# Altium schematic sheet two.SchDoc
size A4
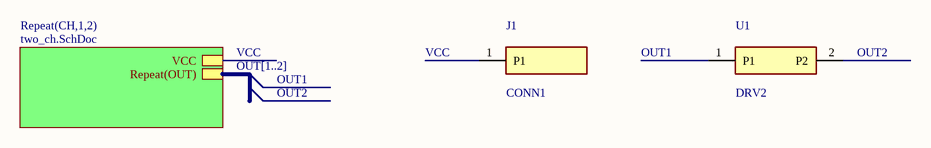
[diagram p0: two.SchDoc]

## Parts
J1  CONN1
U1  DRV2

## Sub-sheets
Repeat(CH,1,2) = two_ch.SchDoc: VCC, Repeat(OUT)

## Nets
OUT1: U1.1(P1)
OUT2: U1.2(P2)
VCC: J1.1(P1) ; sheet Repeat(CH,1,2)/VCC

## Buses and harness runs
bus OUT[1..2] = sheet Repeat(CH,1,2)/Repeat(OUT)

## Library data of the parts
J1 = CONN
U1 = DRIVER